# Altium schematic sheet 09-LED.SchDoc
size A4
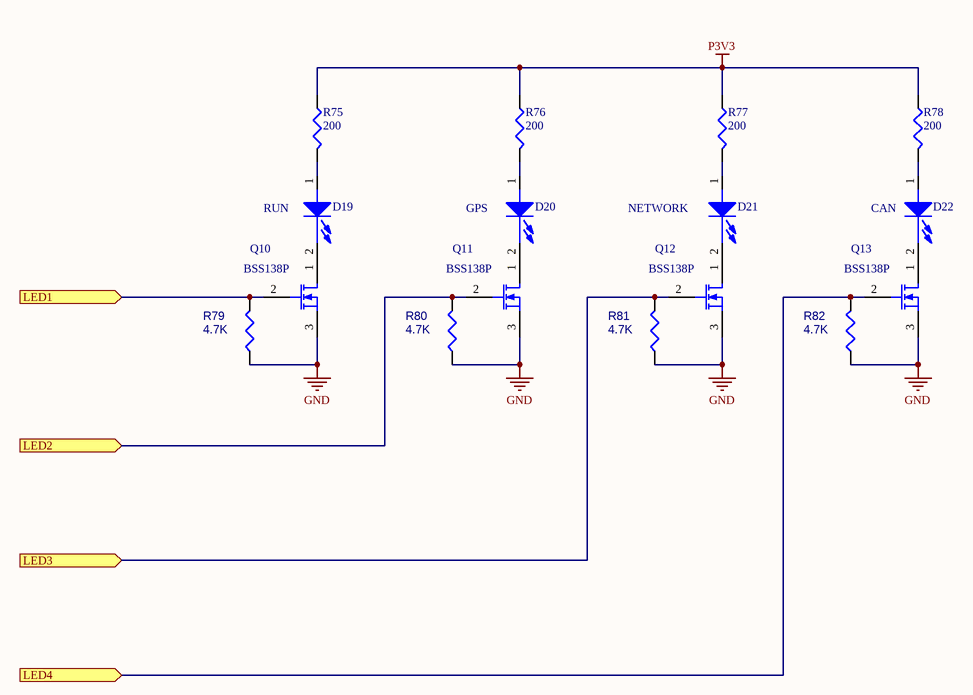
[diagram p0: 09-LED.SchDoc]

## Parts
D19  LED GREEN  [LED-3MM]  (value not drawn)
D20  LED GREEN  [LED-3MM]  (value not drawn)
D21  LED GREEN  [LED-3MM]  (value not drawn)
D22  LED GREEN  [LED-3MM]  (value not drawn)
Q10  BSS138P  [NPN]
Q11  BSS138P  [NPN]
Q12  BSS138P  [NPN]
Q13  BSS138P  [NPN]
R75  200  [0402]
R76  200  [0402]
R77  200  [0402]
R78  200  [0402]
R79  4.7K  [0402]
R80  4.7K  [0402]
R81  4.7K  [0402]
R82  4.7K  [0402]

## Ports
LED1 (in), LED2 (in), LED3 (in), LED4 (in)

## Nets
GND: Q10.3(S) Q11.3(S) Q12.3(S) Q13.3(S) R79.1 R80.1 R81.1 R82.1
P3V3: R75.1 R76.1 R77.1 R78.1
LED1: Q10.2(G) R79.2 ; port LED1
LED2: Q11.2(G) R80.2 ; port LED2
LED3: Q12.2(G) R81.2 ; port LED3
LED4: Q13.2(G) R82.2 ; port LED4
NetD19_1: D19.1(ANODE) R75.2
NetD19_2: D19.2(CATHODE) Q10.1(D)
NetD20_1: D20.1(ANODE) R76.2
NetD20_2: D20.2(CATHODE) Q11.1(D)
NetD21_1: D21.1(ANODE) R77.2
NetD21_2: D21.2(CATHODE) Q12.1(D)
NetD22_1: D22.1(ANODE) R78.2
NetD22_2: D22.2(CATHODE) Q13.1(D)

## Notes on the sheet
- (near D19) RUN
- (near D20) GPS
- NETWORK
- (near D22) CAN

## Library data of the parts
D19-D22 = LN01401_1
Q10-Q13 = MOSFET-N: N-Channel MOSFET; Published: 8-Jun-2000; LatestRevisionDate: 17-Jul-2002; LatestRevisionNote: Re-released for DXP Platform.; PackageVersion: 1995/1996; PackageReference: E3; Publisher: Altium Limited; PackageDescription: TO, Flat Index; 3 In-Line, Axial Leads; Body Dia. 4.6mm; Lead Dia. 0.5 mm (max)
R75-R78 = CR16-1003FM
R79-R82 = R